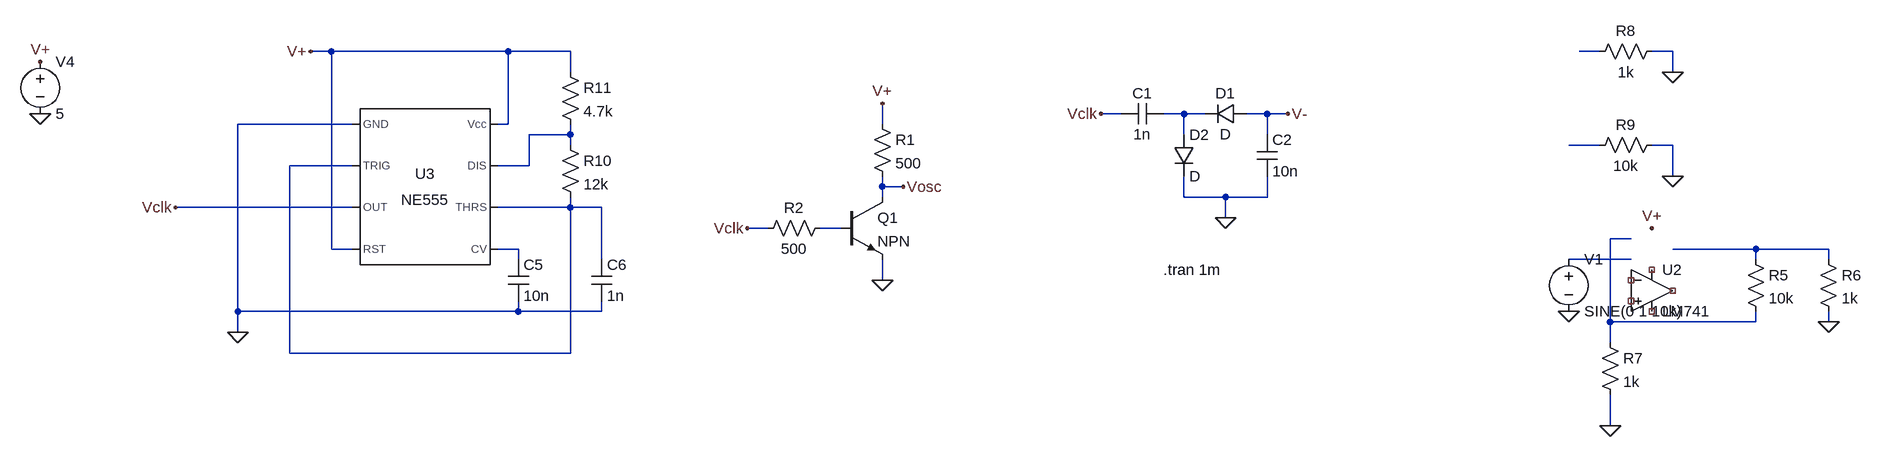
[diagram p0: schematic Lab Project_1.asc]
Lab Project_1.asc, the LTspice schematic file:
Version 4
SHEET 1 1188 724
WIRE -1328 -112 -1360 -112
WIRE -1056 -112 -1328 -112
WIRE -960 -112 -1056 -112
WIRE 624 -112 592 -112
WIRE 736 -112 704 -112
WIRE -960 -80 -960 -112
WIRE 736 -80 736 -112
WIRE -112 -16 -144 -16
WIRE -16 -16 -48 -16
WIRE 16 -16 -16 -16
WIRE 112 -16 80 -16
WIRE 144 -16 112 -16
WIRE -1296 0 -1472 0
WIRE -1056 0 -1056 -112
WIRE -1056 0 -1072 0
WIRE -480 0 -480 -32
WIRE -960 16 -960 0
WIRE -960 16 -1024 16
WIRE -16 16 -16 -16
WIRE 112 16 112 -16
WIRE -960 32 -960 16
WIRE 624 32 576 32
WIRE 736 32 704 32
WIRE -1296 64 -1392 64
WIRE -1024 64 -1024 16
WIRE -1024 64 -1072 64
WIRE 736 80 736 32
WIRE -480 96 -480 80
WIRE -448 96 -480 96
WIRE -480 112 -480 96
WIRE -16 112 -16 80
WIRE 48 112 -16 112
WIRE 112 112 112 80
WIRE 112 112 48 112
WIRE -1296 128 -1568 128
WIRE -960 128 -960 112
WIRE -960 128 -1072 128
WIRE -912 128 -960 128
WIRE 48 144 48 112
WIRE -656 160 -688 160
WIRE -544 160 -576 160
WIRE 672 176 640 176
WIRE -1328 192 -1328 -112
WIRE -1296 192 -1328 192
WIRE -1040 192 -1072 192
WIRE 864 192 736 192
WIRE 976 192 864 192
WIRE -1040 208 -1040 192
WIRE -912 208 -912 128
WIRE 672 208 576 208
WIRE 864 208 864 192
WIRE 976 208 976 192
WIRE -480 240 -480 208
WIRE -1472 288 -1472 0
WIRE -1040 288 -1040 272
WIRE -1040 288 -1472 288
WIRE -912 288 -912 272
WIRE -912 288 -1040 288
WIRE 640 304 640 176
WIRE 864 304 864 288
WIRE 864 304 640 304
WIRE 976 304 976 288
WIRE -1472 320 -1472 288
WIRE 640 336 640 304
WIRE -1392 352 -1392 64
WIRE -960 352 -960 128
WIRE -960 352 -1392 352
WIRE 640 464 640 416
FLAG -1776 -96 V+
FLAG -480 -32 V+
FLAG -688 160 Vclk
FLAG -480 240 0
FLAG -448 96 Vosc
FLAG 48 144 0
FLAG -1776 -16 0
FLAG 976 304 0
FLAG 640 464 0
FLAG 576 288 0
FLAG 704 160 V+
FLAG 736 80 0
FLAG 736 -80 0
FLAG -144 -16 Vclk
FLAG 144 -16 V-
FLAG -1472 320 0
FLAG -1360 -112 V+
FLAG -1568 128 Vclk
SYMBOL voltage -1776 -112 R0
WINDOW 123 0 0 Left 0
WINDOW 39 0 0 Left 0
SYMATTR InstName V4
SYMATTR Value 5
SYMBOL res -496 -16 R0
SYMATTR InstName R1
SYMATTR Value 500
SYMBOL res -560 144 R90
WINDOW 0 0 56 VBottom 2
WINDOW 3 32 56 VTop 2
SYMATTR InstName R2
SYMATTR Value 500
SYMBOL cap -48 -32 R90
WINDOW 0 0 32 VBottom 2
WINDOW 3 32 32 VTop 2
SYMATTR InstName C1
SYMATTR Value 1n
SYMBOL cap 96 16 R0
SYMATTR InstName C2
SYMATTR Value 10n
SYMBOL OpAmps\\LM741 704 192 R0
SYMATTR InstName U2
SYMBOL res 848 192 R0
SYMATTR InstName R5
SYMATTR Value 10k
SYMBOL res 960 192 R0
SYMATTR InstName R6
SYMATTR Value 1k
SYMBOL res 624 320 R0
SYMATTR InstName R7
SYMATTR Value 1k
SYMBOL voltage 576 192 R0
WINDOW 123 0 0 Left 0
WINDOW 39 0 0 Left 0
SYMATTR InstName V1
SYMATTR Value SINE(0 1 10k)
SYMBOL res 720 -128 R90
WINDOW 0 0 56 VBottom 2
WINDOW 3 32 56 VTop 2
SYMATTR InstName R8
SYMATTR Value 1k
SYMBOL res 720 16 R90
WINDOW 0 0 56 VBottom 2
WINDOW 3 32 56 VTop 2
SYMATTR InstName R9
SYMATTR Value 10k
SYMBOL npn -544 112 R0
SYMATTR InstName Q1
SYMBOL diode 80 -32 R90
WINDOW 0 0 32 VBottom 2
WINDOW 3 32 32 VTop 2
SYMATTR InstName D1
SYMBOL diode -32 16 R0
SYMATTR InstName D2
SYMBOL Misc\\NE555 -1184 96 R0
SYMATTR InstName U3
SYMBOL res -976 16 R0
SYMATTR InstName R10
SYMATTR Value 12k
SYMBOL res -976 -96 R0
SYMATTR InstName R11
SYMATTR Value 4.7k
SYMBOL cap -1056 208 R0
SYMATTR InstName C5
SYMATTR Value 10n
SYMBOL cap -928 208 R0
SYMATTR InstName C6
SYMATTR Value 1n
TEXT -48 224 Left 2 !.tran 1m

The netlist it stands for:
* Lab Project_1.asc
V4 V+ 0 5
R1 V+ Vosc 500
R2 N006 Vclk 500
C1 N002 Vclk 1n
C2 V- 0 10n
XU2 NC_01 NC_02 NC_03 NC_04 NC_05 LM741  ; pins In+ In- V+ V- OUT
R5 N009 N007 10k
R6 N009 0 1k
R7 N007 0 1k
V1 N010 0 SINE(0 1 10k)
R8 0 N001 1k
R9 0 N004 10k
Q1 Vosc N006 0 0 NPN
D1 V- N002 D
D2 N002 0 D
XU3 0 N005 Vclk V+ N008 N005 N003 V+ NE555  ; pins GND TRIG OUT RST CV THRS DIS Vcc
R10 N003 N005 12k
R11 V+ N003 4.7k
C5 N008 0 10n
C6 N005 0 1n
.model D D
.lib standard.dio
.model NPN NPN
.model PNP PNP
.lib standard.bjt
.tran 1m
.lib LM741.lib
.lib NE555.sub
.backanno
.end